# EAGLE design Addon-mapleCUx_HM-RFM69-RFM95-V11-019 (EAGLE 7.6.0)
MAPLE-CUx Large Version
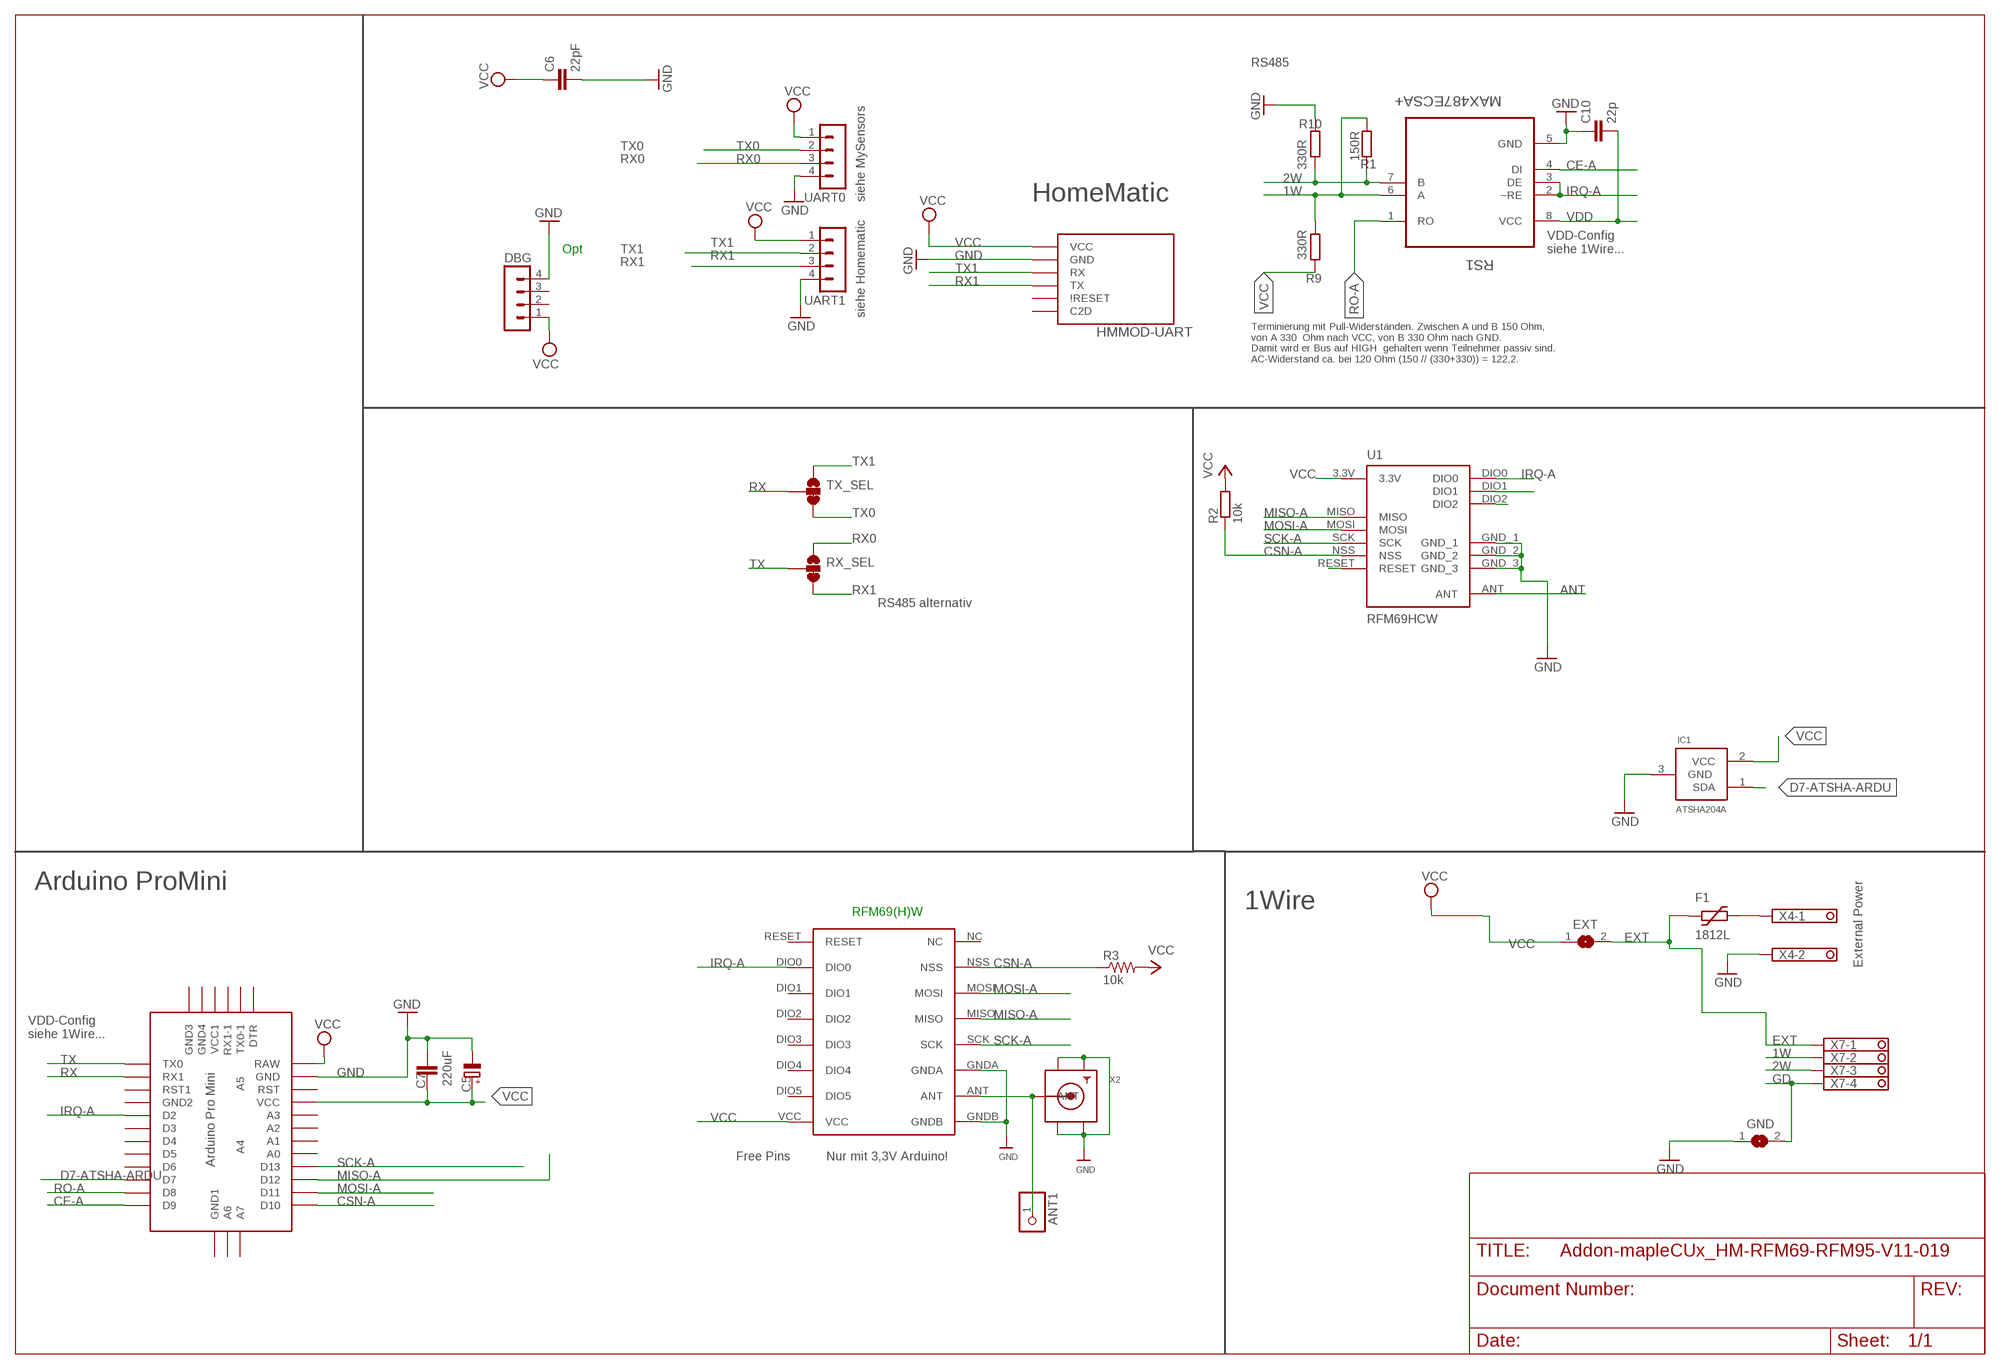
[diagram p0: schematic, sheet 1]

## Parts
ANT1  PINHD-1X1  [1X01]
C5  220uF  CPOL-EUE5-8.5  [E5-8,5]
C6  22pF  C-EUC0805  [C0805]
C7  C-EUC1812  [C1812]
C10  22p  C-EUC0805  [C0805]
DBG  MA04-1  [MA04-1]
EXT  SJ  [SJ]
F1  1812L  [1812L]
GND  SJ  [SJ]
HMMOD-UART  HM-MOD-UARTDIL  [HM-MOD-UART-DIL]
IC1  ATSHA204A  [SOT23]
R1  150R  R-EU_R0805  [R0805]
R2  10k  R-EU_M0805  [M0805]
R3  10k  RESISTOR0805-RES  [0805]
R9  330R  R-EU_R0805  [R0805]
R10  330R  R-EU_R0805  [R0805]
RFM69W  RFM69HW  [RFM]
RS1  MAX487ECSA+  [SOIC127P600X175-8N]
RX_SEL  JUMPER-SMT_3_1-NC_TRACE_SILK  [SMT-JUMPER_3_1-NC_TRACE_SILK]
TX_SEL  JUMPER-SMT_3_1-NC_TRACE_SILK  [SMT-JUMPER_3_1-NC_TRACE_SILK]
U1  RFM69HCW  [RFM69HCW-XXXS2]
U$2  ABK-PRO-MINI  [ABK-PRO-MINI]
UART0  MA04-1  [MA04-1]
UART1  MA04-1  [MA04-1]
X2  SMACONNECTOR_EDGE  [SMA_EDGELAUNCH]
X4  1751248  [1751248]
X7  1751264  [1751264]

## Nets
1W: R1.1 R9.2 RS1.6(A) X7.2
2W: R1.2 R10.1 RS1.7(B) X7.3
ANT: ANT1.1 RFM69W.ANT U1.ANT X2.P(ANT)
CE-A: RS1.4(DI) U$2.D9
CSN-A: R2.1 R3.1 RFM69W.NSS U1.NSS U$2.D10
D7-ATSHA-ARDU: IC1.1(SDA) U$2.D7
EXT [PWR]: EXT.2 F1.P$1 X7.1
GD [PWR]: GND.2 X7.4
GND [PWR]: C5.- C6.2 C7.1 C10.1 DBG.4 GND.1 HMMOD-UART.2(GND) IC1.3(GND) R10.2 RFM69W.GNDA RFM69W.GNDB RS1.5(GND) U1.GND_1 U1.GND_2 U1.GND_3 U$2.GND UART0.4 UART1.4 X2.GND@1(GND4) X2.GND@2(GND3) X2.GND@3(GND2) X2.GND@4(GND1) X4.2
IRQ-A: RFM69W.DIO0 RS1.2(~RE) RS1.3(DE) U1.DIO0 U$2.D2
MISO-A: RFM69W.MISO U1.MISO U$2.D12
MOSI-A: RFM69W.MOSI U1.MOSI U$2.D11
N$2: U1.RESET
N$14: U1.DIO2
N$15: U1.DIO1
N$45 [PWR]: F1.P$2 X4.1
RO-A: RS1.1(RO) U$2.D8
RX: TX_SEL.2 U$2.RX1
RX0: RX_SEL.1 UART0.3
RX1: HMMOD-UART.5(TX) RX_SEL.3 UART1.3
SCK-A: RFM69W.SCK U1.SCK U$2.D13
TX: RX_SEL.2 U$2.TX0
TX0: TX_SEL.3 UART0.2
TX1: HMMOD-UART.6(RX) TX_SEL.1 UART1.2
VCC [PWR]: C5.+ C6.1 C7.2 DBG.1 EXT.1 HMMOD-UART.1(VCC) IC1.2(VCC) R2.2 R3.2 R9.1 RFM69W.VCC U1.3.3V U$2.RAW U$2.VCC UART0.1 UART1.1
VDD [PWR]: C10.2 RS1.8(VCC)
Unconnected: DBG.2 DBG.3 HMMOD-UART.3(C2D) HMMOD-UART.4(\!RESET) RFM69W.DIO1 RFM69W.DIO2 RFM69W.DIO3 RFM69W.DIO4 RFM69W.DIO5 RFM69W.NC RFM69W.RESET U$2.A0 U$2.A1 U$2.A2 U$2.A3 U$2.A4 U$2.A5 U$2.A6 U$2.A7 U$2.D3 U$2.D4 U$2.D5 U$2.D6 U$2.DTR U$2.GND1(GND2) U$2.GND2(GND3) U$2.GND3(GND4) U$2.GND4(GND1) U$2.RST U$2.RST1 U$2.RX1-1 U$2.TX0-1 U$2.VCC1

## Notes on the sheet
- RS485
- siehe MySensors | HomeMatic
- Opt
- VDD-Config
  siehe 1Wire...
- siehe Homematic
- Terminierung mit Pull-Widerständen. Zwischen A und B 150 Ohm,
  von A 330  Ohm nach VCC, von B 330 Ohm nach GND. 
  Damit wird er Bus auf HIGH  gehalten wenn Teilnehmer passiv sind.
  AC-Widerstand ca. bei 120 Ohm (150 // (330+330)) = 122,2.
- RS485 alternativ
- Arduino ProMini
- 1Wire
- RFM69(H)W
- External Power
- VDD-Config
  siehe 1Wire...
- Free Pins | Nur mit 3,3V Arduino!

## Library data of the parts
ANT1 = pinhead:PINHD-1X1: PIN HEADER
C5 = rcl:CPOL-EU: POLARIZED CAPACITOR, European symbol
C6 C7 C10 = rcl:C-EU: CAPACITOR, European symbol
DBG UART0 UART1 = con-lstb:MA04-1: PIN HEADER; OC_FARNELL: unknown; OC_NEWARK: unknown
EXT GND = jumper:SJ: SMD solder JUMPER
F1 = ptc-littlefuse:1812L
HMMOD-UART = wireless:HM-MOD-UART: eQ3 HM-MOD-UART-AW-SH2 wireless module for 868 MHz. DIL version for mounting with pin header (antenna upwards) and SMD variant available (antenna downwards).
IC1 = Sensor:ATSHA204A
R1 R2 R9 R10 = rcl:R-EU_: RESISTOR, European symbol
R3 = doug:RESISTOR: Resistor Basic schematic elements and footprints for 0603, 1206, and PTH resistors.
RFM69W = hoperf:RFM69HW
RS1 = Maxim_By_element14_Batch_1:MAX487ECSA+: Low-Power, Slew-Rate-Limited RS-485/RS-422 Transceivers; MPN: MAX487ECSA+; OC_FARNELL: 9724532; OC_NEWARK: 68K4803; PACKAGE: SOIC-8; SUPPLIER: Maxim
RX_SEL TX_SEL = SparkFun-Jumpers:JUMPER-SMT_3_1-NC_TRACE: Normally closed trace jumper (1 of 2 connections) This jumper has a trace between two pads so it's normally closed (NC). The other connection is normally open (NO). Use a razor knife to open the connection. For best results follow the IPC guidelines for cutting traces: Cutout at least 0.063 mm (0.005 in). Remove all loose material to clean up the cut area. Seal the cut with an approved epoxy. Reapply solder to reclose the connection, or to close the NO connection.
U1 = doug:RFM69H
U$2 = Arduino-clone:ABK-PRO-MINI: ABK Pro-Mini Arduino Clone
X2 = adafruit:SMACONNECTOR: SMA Connector 90° DIP SMA Connector, 50 Ohm (4UConnector: 07259)
X4 = con-phoenix-350:1751248: MKDS 1/ 2-3,5 Printklemme Nennstrom: 10 A Bemessungsspannung: 160 V Raster: 3,5 mm Polzahl: 2 Montageart: Löten Anschlussart: Schraubanschluss Anschlussrichtung vom Leiter zur Platine: 0° Source: http://eshop.phoenixcontact.com .. 1751248.pdf; OC_FARNELL: unknown; OC_NEWARK: unknown
X7 = con-phoenix-350:1751264: MKDS 1/ 4-3,5 Printklemme Nennstrom: 10 A Bemessungsspannung: 160 V Raster: 3,5 mm Polzahl: 4 Montageart: Löten Anschlussart: Schraubanschluss Anschlussrichtung vom Leiter zur Platine: 0° Source: http://eshop.phoenixcontact.com .. 1751264.pdf; MPN: 1751264; OC_FARNELL: unknown; OC_NEWARK: 10R0934

## Net classes
0 default: width 0.305 mm
1 PWR: width 0.457 mm

## Board
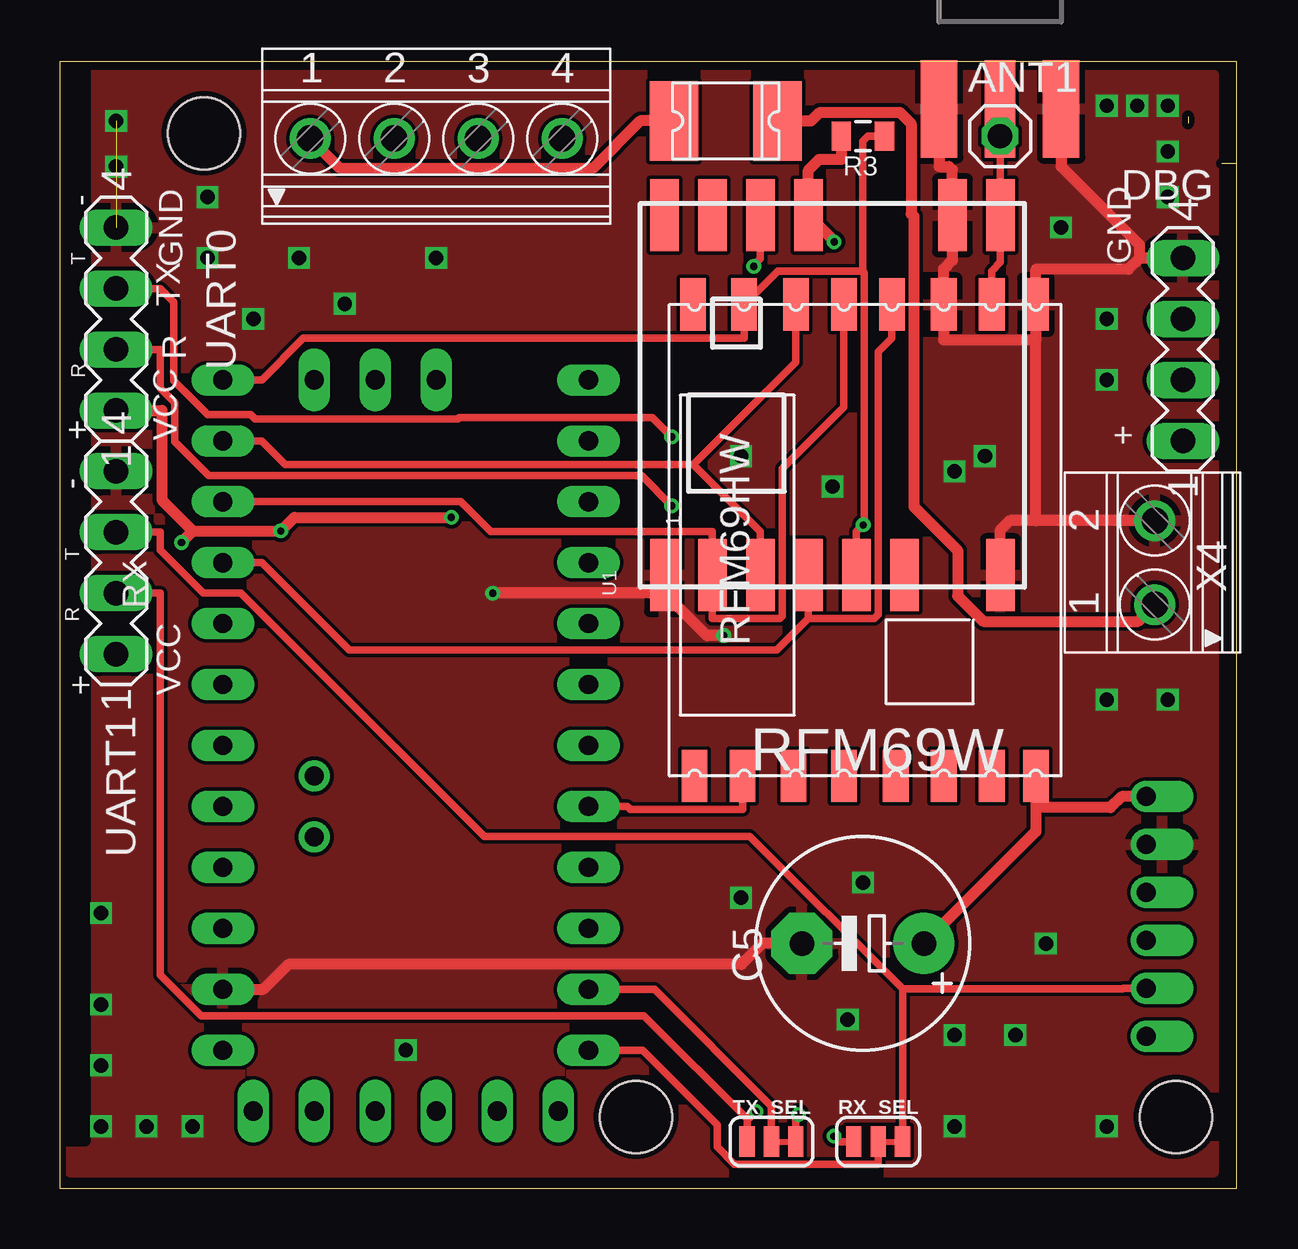
[diagram p1: board, top side]
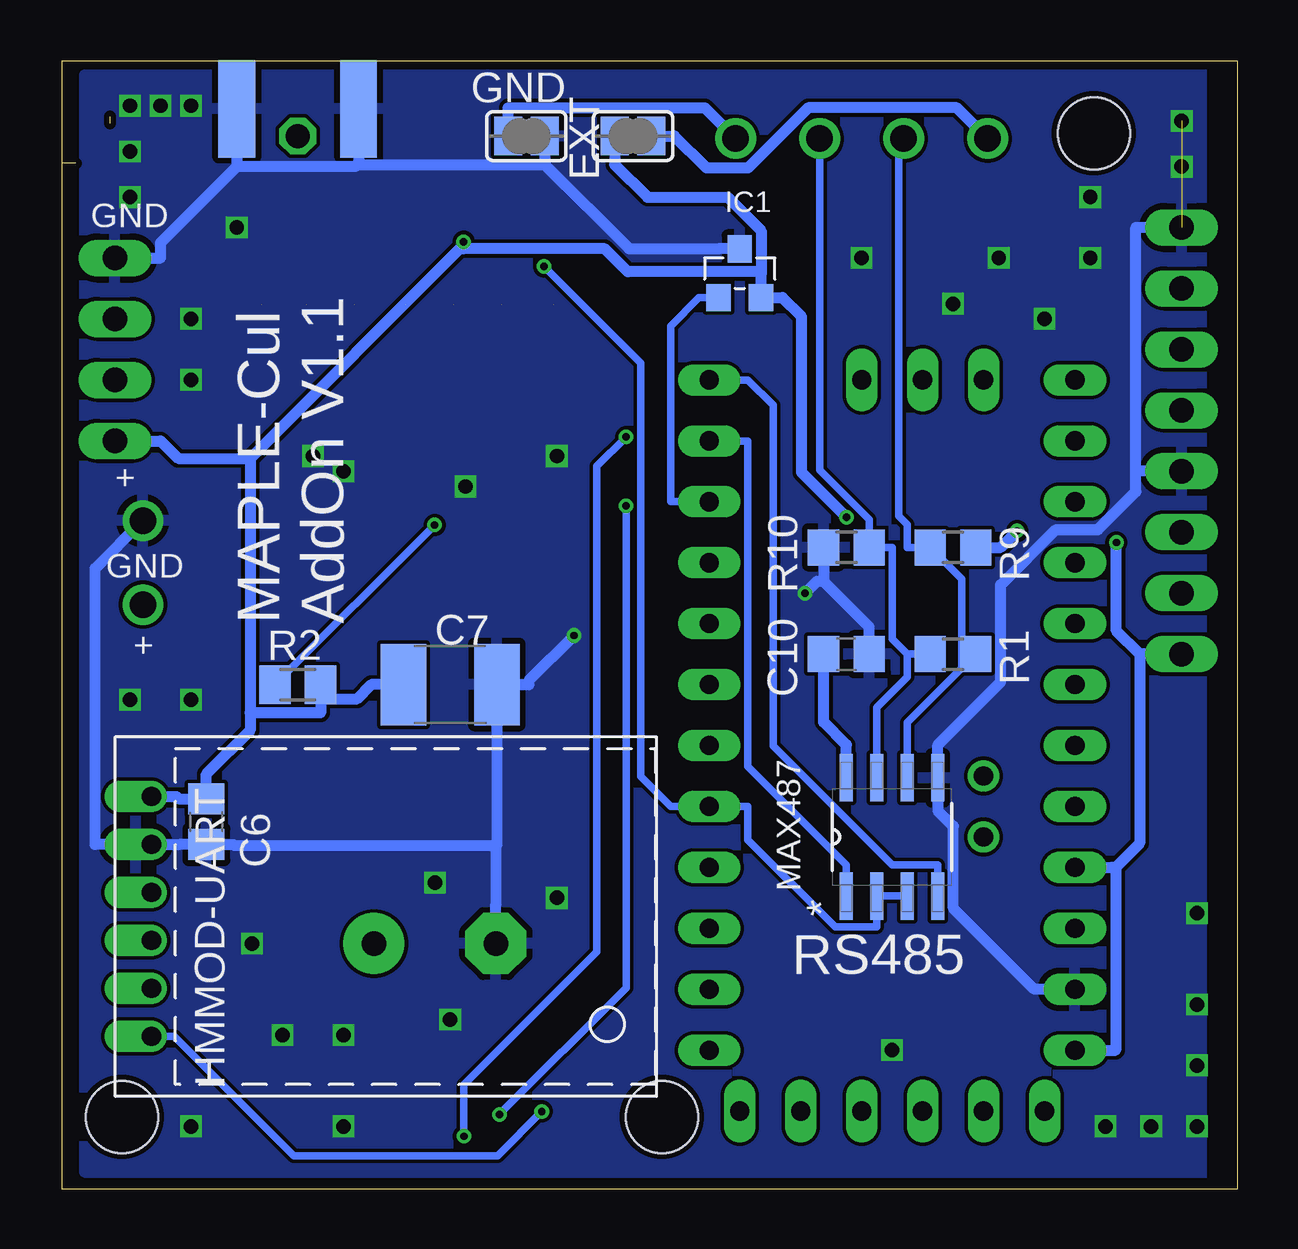
[diagram p2: board, bottom side, seen from below]

Size 49 x 47 mm. Coordinates in mm from the lower left corner, seen from the top.
Outline: 49,47 49,46.24
Outline: 47,44.7 47,44.41
Outline: 48.41,42.75 49,42.75
Outline: 49,47 0,47 0,0 49,0 49,42.75
Outline: 49,47 49,42.75
Copper layers (1*16): Top 0.035mm / dielectric 1.5mm / Bottom 0.035mm
Design rules "SeeedStudio_2layer_DRU_no_angle_20140221": minimum track width 6mil, minimum drill 12mil, track to track 6mil, track to pad 6mil, pad to pad 6mil, via to via 6mil, smd to smd 0mil, copper to edge 10mil, drill to drill 10mil, minimum pad ring 10mil, minimum via ring 6mil, stop-mask expansion 2mil, vias tented up to drill 100mil, thermal gap 10mil
Holes 3 mm at 6,44 24,3 46.5,3
tRestrict: area 0.4,2 to 1.1,47.1
bRestrict: area 0.4,0.7 to 1.1,46.4

### Footprints (pad centres in the part's own frame; a part is rotated, then mirrored left to right if it is on the bottom)
1X01 = drill 1.016 octagon: 1 0,0
E5-8,5 = drill 1.016 pad 2.54: + -2.54,0 | drill 1.016 pad 2.54 octagon: - 2.54,0
C0805 = smd 1.3 x 1.5: 1 -0.95,0; 2 0.95,0
C1812 = smd 1.9 x 3.4: 1 -1.95,0; 2 1.95,0
MA04-1 = drill 1.016 long: 1 -3.81,0; 2 -1.27,0; 3 1.27,0; 4 3.81,0
SJ = smd 1.168 x 1.6: 1 -0.762,0; 2 0.762,0
1812L = smd 2.03 x 3.3: P$1 -2.16,0; P$2 2.16,0
HM-MOD-UART-DIL = drill 0.8 offset: 1 0,12; 2 0,10; 3 0,8; 4 0,6; 5 0,4; 6 0,2
SOT23 = smd 1.016 x 1.143: 1 -0.889,-1.016; 2 0.889,-1.016; 3 0,1.016
R0805 = smd 1.3 x 1.5: 1 -0.95,0; 2 0.95,0
M0805 = smd 1.3 x 1.6: 1 -0.95,0; 2 0.95,0
0805 = smd 0.8 x 1.2: 1 -0.9,0; 2 0.9,0
RFM = smd 2.184 x 1.067: ANT 19.651,2.889; DIO0 0,13.27; DIO1 0,11.143; DIO2 0,9.047; DIO3 0,6.889; DIO4 0,4.889; DIO5 0,2.889; GNDA 19.651,4.889; GNDB 19.651,1.048; MISO 19.651,9.047; MOSI 19.651,11.047; NC 19.651,15.334; NSS 19.651,13.206; RESET 0,15.27; SCK 19.651,7.048; VCC 0,1.048
SOIC127P600X175-8N = smd 1.981 x 0.533: 1 -2.464,1.905; 2 -2.464,0.635; 3 -2.464,-0.635; 4 -2.464,-1.905; 5 2.464,-1.905; 6 2.464,-0.635; 7 2.464,0.635; 8 2.464,1.905
SMT-JUMPER_3_1-NC_TRACE_SILK = smd 0.635 x 1.27: 1 -1.016,0; 2 0,0; 3 1.016,0
RFM69HCW-XXXS2 = smd 3 x 1.2: 3.3V 7.5,1; ANT 7.5,-7; DIO0 7.5,3; DIO1 7.5,5; DIO2 7.5,7; GND_1 7.5,-5; GND_2 -7.5,-7; GND_3 -7.5,7; MISO -7.5,5; MOSI -7.5,3; NSS -7.5,-1; RESET -7.5,-3; SCK -7.5,1
ABK-PRO-MINI = drill 0.8 long: A0 10.16,-3.81; A1 10.16,-6.35; A2 10.16,-8.89; A3 10.16,-11.43; A6 3.81,-21.59; A7 6.35,-21.59; D2 -5.08,-3.81; D3 -5.08,-6.35; D4 -5.08,-8.89; D5 -5.08,-11.43; D6 -5.08,-13.97; D7 -5.08,-16.51; D8 -5.08,-19.05; D9 -5.08,-21.59; D10 10.16,-21.59; D11 10.16,-19.05; D12 10.16,-16.51; D13 10.16,-13.97; DTR 8.89,8.89; GND 10.16,3.81; GND1 -5.08,-1.27; GND2 -3.81,8.89; GND3 -1.27,8.89; GND4 1.27,-21.59; RAW 10.16,6.35; RST 10.16,1.27; RST1 -5.08,1.27; RX1 -5.08,3.81; RX1-1 3.81,8.89; TX0 -5.08,6.35; TX0-1 6.35,8.89; VCC 10.16,-1.27; VCC1 1.27,8.89 | drill 0.8: A4 6.35,-5.08; A5 6.35,-2.54
SMA_EDGELAUNCH = smd 4.064 x 1.524: GND@1 2.032,-2.54; GND@2 2.032,2.54 | smd 4.064 x 1.524 bottom: GND@3 2.032,2.54; GND@4 2.032,-2.54 | smd 4.064 x 1.27: P 2.032,0
1751248 = drill 1.1 pad 1.7: 1 -1.75,-0.1; 2 1.75,-0.1
1751264 = drill 1.1 pad 1.7: 1 -5.25,-0.1; 2 -1.75,-0.1; 3 1.75,-0.1; 4 5.25,-0.1

### Placement (x,y rotation side)
ANT1  39.17,43.88 0 top
C5  33.45,10.23 180 top
C6  42.98,15.3 270 bottom
C7  32.82,21.02 180 bottom
C10  16.31,22.29 180 bottom
DBG  46.79,34.99 90 top
EXT  25.2,43.88 0 bottom
F1  27.74,44.52 0 top
GND  29.64,43.88 180 bottom
HMMOD-UART  45.27,4.35 0 bottom
IC1  20.75,38.16 0 bottom
R1  11.87,22.29 180 bottom
R2  39.17,21.02 0 bottom
R3  33.45,43.88 180 top
R9  11.87,26.73 180 bottom
R10  16.31,26.73 180 bottom
RFM69W  41.71,17.21 90 top
RS1  14.41,14.67 90 bottom
RX_SEL  34.09,1.97 0 top
TX_SEL  29.64,1.97 0 top
U1  32.19,33.09 90 top
U$2  16.94,12.13 180 top
UART0  2.34,36.26 90 top
UART1  2.34,26.1 90 top
X2  39.17,47.05 270 top
X4  45.52,26.1 90 top
X7  15.67,43.88 0 top

### Tracks (layer width: path | path; a pad name or v marks a point on that pad's centre or on a via)
1W
  Bottom 0.305: 11.5,22.29 11.5,25.42 R9.2 13.77,26.73 13.77,27.69 14.12,28.04 14.12,43.59 X7.2 | RS1.6 13.77,19.43 11.5,21.7 11.5,22.29 | 11.5,22.29 R1.1
2W
  Bottom 0.305: X7.3 17.42,29.97 15.36,27.91 15.36,27.79 R10.1 14.41,26.73 14.41,22.92 13.77,22.29 | R1.2 13.77,22.29 | RS1.7 15.04,20.06 13.77,21.34 13.77,22.29
ANT  (1 unrouted)
  Top 0.305: RFM69W.ANT 38.82,38.26 39.19,38.62 U1.ANT 39.19,42.39 39.17,42.41 ANT1.1 X2.P
CE-A
  Bottom 0.305: U$2.D9 20.41,33.72 19.36,32.67 19.36,18.46 14.4,13.5 12.5,13.5 RS1.4
CSN-A  (via drill 0.3 pad 0.61)  (1 unrouted)
  Top 0.305: U$2.D10 8.4,33.72 10.14,35.46 28.5,35.46 RFM69W.NSS 29.9,38.26 33.44,38.26 | v33.47,27.67 33.5,27.71 33.5,38.2 33.44,38.26 | v33.47,27.67 33.19,27.39 U1.NSS | v33.47,27.67 | v33.47,27.67 | 33.44,38.26 33.44,43.67 33.65,43.88 R3.1
  Bottom 0.305: R2.1 v33.47,27.67 | v33.47,27.67
D7-ATSHA-ARDU
  Bottom 0.305: IC1.1 22.46,37.15 23.64,35.97 23.64,28.64 U$2.D7
EXT
  Top 0.457: F1.P$1 24.18,44.52 22.22,42.55 11.66,42.55 X7.1
  Bottom 0.457: EXT.2 23.47,43.88 22.14,42.55 20.42,42.55 17.9,45.06 11.71,45.06 X7.1
GD
  Bottom 0.457: X7.4 22.21,45.06 30.41,45.06 GND.2
GND  (via drill 0.3 pad 0.61, 0.6)  (3 unrouted)
  Top 0.457: U$2.GND 8.47,8.32 9.51,9.36 28.39,9.36 29.26,10.23 C5.- | v27.66,23.06 26.95,23.06 25.19,24.83 | 25.19,24.83 v18.03,24.83 | U1.GND_3 25.19,24.83 | 40.66,27.85 39.57,27.85 39.19,27.47 U1.GND_2 | X4.2 40.66,27.85 | 40.66,27.85 40.66,35.39 | X2.GND@2 41.71,42.61 44.98,39.34 44.98,38.8 | 44.98,38.8 44.52,38.34 40.66,38.34 RFM69W.GNDB 40.66,35.39 | 44.98,38.8 45.04,38.8 DBG.4 | 40.66,35.39 36.82,35.39 RFM69W.GNDA 36.82,38.34 37.19,38.7 U1.GND_1 37.19,42.47 37.04,42.61 36.63,42.61 X2.GND@1
  Bottom 0.457: U$2.GND 8.47,8.32 11.85,11.7 11.85,15.11 12.5,15.76 RS1.5 12.5,18.51 9.88,21.12 9.88,25.18 7.58,27.48 5.83,27.48 4.24,29.06 4.24,29.91 | UART0.4 4.24,40.07 4.24,29.91 | 4.24,29.91 4.09,29.91 UART1.4 | v27.66,23.06 29.54,21.18 29.54,21.02 C7.1 30.87,14.35 30.92,14.3 | 36.63,42.74 36.76,42.61 41.71,42.61 | 36.63,42.74 36.59,42.7 28.88,42.7 | 36.63,42.74 36.63,42.81 X2.GND@1 | X2.GND@2 41.71,42.61 | DBG.4 44.89,38.8 44.89,39.44 41.71,42.61 | 17.26,25.32 15.36,23.42 C10.1 | 17.26,25.32 17.26,26.17 R10.2 | 17.26,25.32 17.54,25.32 v18.03,24.83 | 28.88,42.7 25.36,39.18 21.64,39.18 IC1.3 | 30.92,14.3 41.8,14.3 41.85,14.36 C6.2 44.11,14.36 44.11,14.35 HMMOD-UART.2 45.75,14.35 47.61,14.35 47.61,25.86 X4.2 | 30.92,14.3 30.92,11.88 C5.- | GND.1 28.88,42.7
  other vias: 2.34,44.52 2.34,42.61 6.15,41.34 6.15,38.8 9.96,38.8 15.67,38.8 11.87,36.9 28.38,30.55 32.19,29.27 37.27,29.91 38.53,30.55 41.71,40.07 43.61,45.15 44.89,45.15 46.16,45.15 46.16,43.24 46.16,41.34 43.61,36.26 43.61,33.72 46.16,20.38 43.61,20.38 39.81,6.41 37.27,6.41 32.82,7.05 41.08,10.23 43.61,2.61 37.27,2.61 5.52,2.61 3.61,2.61 1.7,2.61 1.7,5.14 1.7,7.68 1.7,11.5 14.41,5.78 8.05,36.26 28.38,12.13 33.45,12.77
  pour Top: 0.44,0.7 0.44,46.42 48.06,46.42 48.06,0.7
  pour Bottom: 0.44,0.7 0.44,46.42 48.06,46.42 48.06,0.7
IRQ-A  (via drill 0.3 pad 0.61)
  Top 0.305: U1.DIO0 29.19,38.78 28.91,38.5 v28.91,38.45 | RFM69W.DIO0 28.44,15.81 23.77,15.81 23.64,15.94 U$2.D2
  Bottom 0.305: v28.91,38.45 24.88,34.42 24.88,17.18 23.64,15.94 U$2.D2 21.6,15.94 20.41,15.94 20.41,14.55 16.78,10.91 15.04,10.91 RS1.2 RS1.3
MISO-A  (1 unrouted)
  Top 0.305: RFM69W.MISO 32.66,32.59 30.09,30.02 30.09,23.88 29.99,23.78 27.19,23.78 U1.MISO 27.19,26.37 27.19,27.39 17.95,27.39 16.7,28.64 8.4,28.64 U$2.D12
MOSI-A  (1 unrouted)
  Top 0.305: 26.39,30.18 | 26.39,30.18 9.39,30.18 8.4,31.18 U$2.D11 | 26.39,30.18 30.66,34.46 30.66,35.46 RFM69W.MOSI | 26.39,30.18 29.19,27.39 U1.MOSI
N$45
  Top 0.457: F1.P$2 31.3,44.52 31.66,44.88 35,44.88 35.47,44.41 35.47,40.65 35.58,40.54 35.58,28.44 37.4,26.62 37.4,24.72 38.46,23.65 44.92,23.65 X4.1
RO-A
  Bottom 0.305: U$2.D8 20.41,31.18 20.41,17.6 16.31,13.5 RS1.1
RX
  Top 0.305: U$2.RX1 24.77,8.32 29.64,3.45 29.64,2.91 TX_SEL.2
RX0  (via drill 0.3 pad 0.61)
  Top 0.305: UART0.3 4.17,37.53 4.74,36.96 4.74,33.69 6.15,32.28 7.94,32.28 8.14,32.08 16.58,32.08 16.64,32.15 24.69,32.15 v25.49,31.34 | RX_SEL.1 32.45,1.97 32.45,1.99 v32.25,2.19
  Bottom 0.305: v32.25,2.19 32.25,4.34 26.71,9.87 26.71,30.12 | 26.71,30.12 | 26.71,30.12 v25.49,31.34
RX1
  Top 0.305: 35.11,8.34 RX_SEL.3 | 35.11,8.34 28.75,14.69 17.67,14.69 7.53,24.83 5.97,24.83 4.17,26.63 4.17,27.37 UART1.3 | 35.11,8.34 44.29,8.34 44.31,8.35 HMMOD-UART.5
SCK-A  (1 unrouted)
  Top 0.305: 31.19,23.78 29.86,22.45 12.05,22.45 8.4,26.1 U$2.D13 | 31.19,23.78 33.93,23.78 34.09,23.94 34.09,34.89 34.66,35.46 RFM69W.SCK | U1.SCK 31.19,23.78
TX
  Top 0.305: RX_SEL.2 34.09,1.03 28.1,1.03 27.38,1.75 27.38,2.68 24.28,5.78 U$2.TX0
TX0  (via drill 0.3 pad 0.61)
  Top 0.305: UART0.2 4.17,34.99 4.17,33.39 4.78,32.78 4.78,31.16 6.21,29.73 24.23,29.73 v25.49,28.47 | v30.77,3.1 30.66,2.99 TX_SEL.3
  Bottom 0.305: v25.49,28.47 25.49,8.38 v30.77,3.1
TX1  (via drill 0.3 pad 0.61)
  Top 0.305: v29,3.23 28.69,2.91 28.63,2.91 | 28.63,2.91 24.33,7.21 5.88,7.21 4.17,8.92 4.17,24.83 UART1.2 | TX_SEL.1 28.63,2.91
  Bottom 0.305: v29,3.23 30.85,1.38 39.34,1.38 44.31,6.35 HMMOD-UART.6
VCC  (via drill 0.3 pad 0.61)
  Top 0.457: v16.31,27.99 9.76,27.99 v9.2,27.42 5.54,27.42 | 5.54,27.42 4.24,28.72 4.24,32.45 UART0.1 | 5.54,27.42 v5.06,26.94 | 40.66,15.89 43.77,15.89 44.23,16.35 HMMOD-UART.1 | 40.66,15.89 40.66,14.89 C5.+ | RFM69W.VCC 40.66,15.89 | R3.2 32.56,42.9 31.62,42.9 31.19,42.47 U1.3.3V 32.26,39.51 v32.26,39.48
  Bottom 0.457: v16.31,27.99 18.18,29.86 18.18,36.35 18.98,37.15 IC1.2 19.87,38.1 19.87,38.23 | 4.09,22.29 5.06,23.26 v5.06,26.94 | 4.09,22.29 4.09,14.4 5.1,13.4 | 4.09,22.29 | U$2.RAW 5.1,5.78 5.1,13.4 | 5.1,13.4 5.25,13.4 U$2.VCC | UART1.1 4.09,22.29 | 32.26,39.18 32.41,39.18 41.15,30.44 | 19.87,38.23 25.42,38.23 26.37,39.18 32.26,39.18 | 32.26,39.18 v32.26,39.48 | DBG.1 44.89,31.18 44.15,30.44 41.15,30.44 | 41.15,30.44 41.15,19.84 | 41.15,19.84 41.15,19.11 42.98,17.29 C6.1 44.14,16.25 44.23,16.35 HMMOD-UART.1 | 41.15,19.84 38.22,19.84 38.22,20.43 | C7.2 36.1,21.02 36.69,20.43 38.22,20.43 | R2.2 38.22,20.43 | EXT.1 25.96,42.7 24.59,41.33 21.26,41.33 19.87,39.93 19.87,38.23 | 19.87,38.23 | v9.2,27.42 9.88,26.73 R9.1
VDD
  Bottom 0.457: RS1.8 16.31,18.51 17.26,19.46 C10.2

### Text on the board
tNames: GND | - | T | GND | TX | R | R | + | VCC | + | - | T | R | RX | VCC | +
bNames: GND | + | GND | MAPLE-Cul / AddOn V1.1 | + | MAX487 | RS485